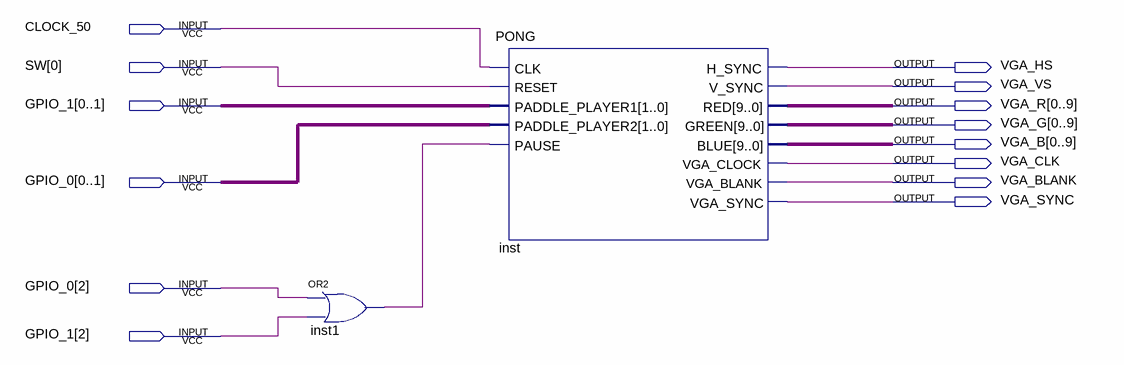
[diagram p0: schematic sheet]
// Quartus schematic main.bdf as structural Verilog: 2 symbols, 14 pins
module main (
  input  CLOCK_50,
  input  [0:0] SW,
  input  [0:2] GPIO_1,
  input  [0:2] GPIO_0,
  output VGA_HS,
  output VGA_VS,
  output [0:9] VGA_R,
  output [0:9] VGA_G,
  output [0:9] VGA_B,
  output VGA_CLK,
  output VGA_BLANK,
  output VGA_SYNC
);

  wire inst1_out;

  or inst1 (inst1_out, GPIO_0[2], GPIO_1[2]);
  PONG inst (
    .CLK(CLOCK_50), .RESET(SW[0]), .PADDLE_PLAYER1(GPIO_1[0:1]), .PADDLE_PLAYER2(GPIO_0[0:1]),
    .PAUSE(inst1_out), .H_SYNC(VGA_HS), .V_SYNC(VGA_VS), .RED(VGA_R), .GREEN(VGA_G), .BLUE(VGA_B),
    .VGA_CLOCK(VGA_CLK), .VGA_BLANK(VGA_BLANK), .VGA_SYNC(VGA_SYNC));
endmodule
